# EAGLE design mainboard (EAGLE 9.6.2)
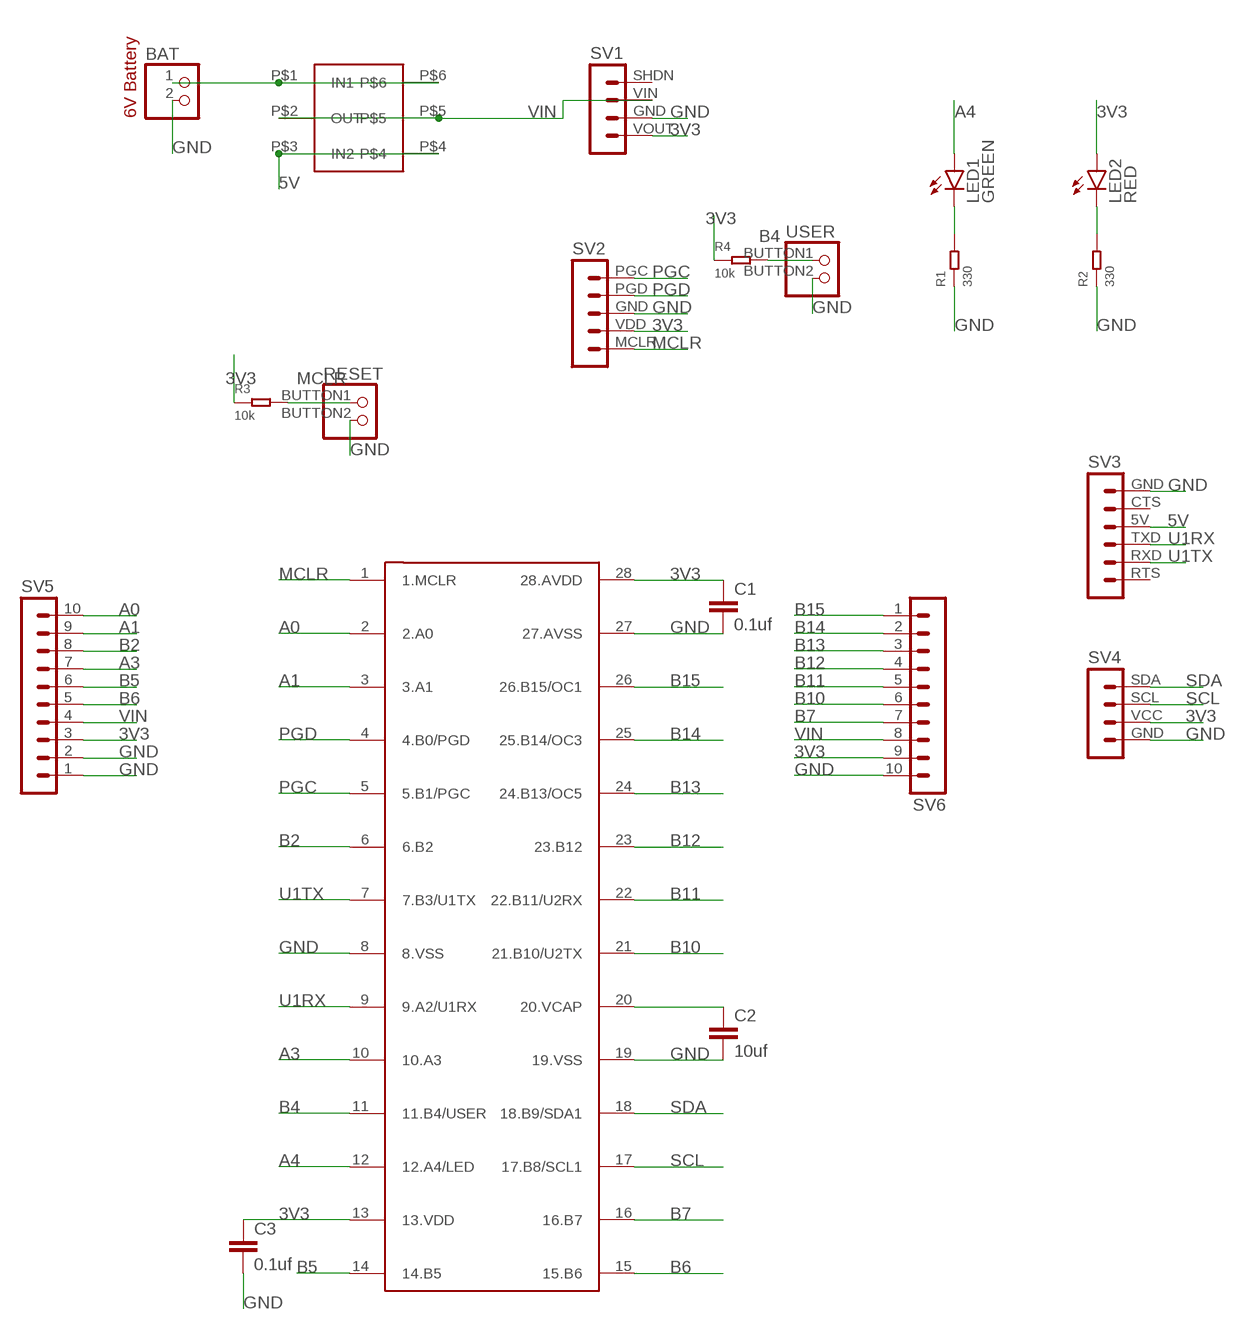
[diagram p0: schematic, sheet 1]

## Parts
BAT  PINHD-1X2  [1X02]
C1  0.1uf  C2,5-3  [C2.5-3]
C2  10uf  C2,5-3  [C2.5-3]
C3  0.1uf  C2,5-3  [C2.5-3]
LED1  GREEN  LED3MM  [LED3MM]
LED2  RED  LED3MM  [LED3MM]
R1  330  DIP-RES-1/4W(PR-D2.3XL6.5MM)  [PR-D2.3XL6.5MM]
R2  330  DIP-RES-1/4W(PR-D2.3XL6.5MM)  [PR-D2.3XL6.5MM]
R3  10k  DIP-RES-1/4W(PR-D2.3XL6.5MM)  [PR-D2.3XL6.5MM]
R4  10k  DIP-RES-1/4W(PR-D2.3XL6.5MM)  [PR-D2.3XL6.5MM]
RESET  PUSHBUTTON  [PUSHBUTTON]
SV1  POLOLU3.3POLOLU3.3  [POLOLU3.3]
SV2  MPLAB-SNAP  [MPLAB-SNAP]
SV3  CP2104FRIEND  [CP2104FRIEND]
SV4  SSD1306  [SSD1306]
SV5  MA10-1  [MA10-1]
SV6  MA10-1  [MA10-1]
U$1  SLIDE_SWITCH  [SLIDE]
U$2  PIC32MX170F256B  [DIL28-3]
USER  PUSHBUTTON  [PUSHBUTTON]

## Nets
3V3: C1.1 C3.1 LED2.A R3.1 R4.1 SV1.VOUT SV2.VDD SV4.VCC SV5.3 SV6.9 U$2.13(13.VDD) U$2.28(28.AVDD)
5V: SV3.5V U$1.P$3(IN2) U$1.P$4
A0: SV5.10 U$2.2(2.A0)
A1: SV5.9 U$2.3(3.A1)
A3: SV5.7 U$2.10(10.A3)
A4: LED1.A U$2.12(12.A4/LED)
B2: SV5.8 U$2.6(6.B2)
B4: R4.2 U$2.11(11.B4/USER) USER.BUTTON1
B5: SV5.6 U$2.14(14.B5)
B6: SV5.5 U$2.15(15.B6)
B7: SV6.7 U$2.16(16.B7)
B10: SV6.6 U$2.21(21.B10/U2TX)
B11: SV6.5 U$2.22(22.B11/U2RX)
B12: SV6.4 U$2.23(23.B12)
B13: SV6.3 U$2.24(24.B13/OC5)
B14: SV6.2 U$2.25(25.B14/OC3)
B15: SV6.1 U$2.26(26.B15/OC1)
GND: BAT.2 C1.2 C2.2 C3.2 R1.1 R2.1 RESET.BUTTON2 SV1.GND SV2.GND SV3.GND SV4.GND SV5.1 SV5.2 SV6.10 U$2.8(8.VSS) U$2.19(19.VSS) U$2.27(27.AVSS) USER.BUTTON2
MCLR: R3.2 RESET.BUTTON1 SV2.MCLR U$2.1(1.MCLR)
N$1: BAT.1 U$1.P$1(IN1) U$1.P$6
N$4: LED1.K(C) R1.2
N$7: LED2.K(C) R2.2
N$13: C2.1 U$2.20(20.VCAP)
PGC: SV2.PGC U$2.5(5.B1/PGC)
PGD: SV2.PGD U$2.4(4.B0/PGD)
SCL: SV4.SCL U$2.17(17.B8/SCL1)
SDA: SV4.SDA U$2.18(18.B9/SDA1)
U1RX: SV3.TXD U$2.9(9.A2/U1RX)
U1TX: SV3.RXD U$2.7(7.B3/U1TX)
VIN: SV1.VIN SV5.4 SV6.8 U$1.P$2(OUT) U$1.P$5
Unconnected: SV1.SHDN SV3.CTS SV3.RTS

## Notes on the sheet
- 6V Battery

## Library data of the parts
BAT = pinhead:PINHD-1X2: PIN HEADER
C1-C3 = HW4:C: CAPACITOR naming: grid - package width
LED1 LED2 = HW4:LED: LED OSRAM: - CHIPLED LG R971, LG N971, LY N971, LG Q971, LY Q971, LO R971, LY R971 LH N974, LH R974 LS Q976, LO Q976, LY Q976 LO Q996 - Hyper CHIPLED LW Q18S LB Q993, LB Q99A, LB R99A - SideLED LS A670, LO A670, LY A670, LG A670, LP A670 LB A673, LV A673, LT A673, LW A673 LH A674 LY A675 LS A676, LA A676, LO A676, LY A676, LW A676 LS A679, LY A679, LG A679 - Hyper Micro SIDELED® LS Y876, LA Y876, LO Y876, LY Y876 LT Y87S - SmartLED LW L88C, LW L88S LB L89C, LB L89S, LG L890 LS L89K, LO L89K, LY L89K LS L896, LA L896, LO L896, LY L896 - TOPLED LS T670, LO T670, LY T670, LG T670, LP T670 LSG T670, LSP T670, LSY T670, LOP T670, LYG T670 LG T671, LOG T671, LSG T671 LB T673, LV T673, LT T673, LW T673 LH T674 LS T676, LA T676, LO T676, LY T676, LB T676, LH T676, LSB T676, LW T676 LB T67C, LV T67C, LT T67C, LS T67K, LO T67K, LY T67K, LW E67C LS E67B, LA E67B, LO E67B, LY E67B, LB E67C, LV E67C, LT E67C LW T67C LS T679, LY T679, LG T679 LS T770, LO T770, LY T770, LG T770, LP T770 LB T773, LV T773, LT T773, LW T773 LH T774 LS E675, LA E675, LY E675, LS T675 LS T776, LA T776, LO T776, LY T776, LB T776 LHGB T686 LT T68C, LB T68C - Hyper Mini TOPLED® LB M676 - Mini TOPLED Santana® LG M470 LS M47K, LO M47K, LY M47K Source: http://www.osram.convergy.de LUXEON: - LUMILED® LXK2-PW12-R00, LXK2-PW12-S00, LXK2-PW14-U00, LXK2-PW14-V00 LXK2-PM12-R00, LXK2-PM12-S00, LXK2-PM14-U00 LXK2-PE12-Q00, LXK2-PE12-R00, LXK2-PE12-S00, LXK2-PE14-T00, LXK2-PE14-U00 LXK2-PB12-K00, LXK2-PB12-L00, LXK2-PB12-M00, LXK2-PB14-N00, LXK2-PB14-P00, LXK2-PB14-Q00 LXK2-PR12-L00, LXK2-PR12-M00, LXK2-PR14-Q00, LXK2-PR14-R00 LXK2-PD12-Q00, LXK2-PD12-R00, LXK2-PD12-S00 LXK2-PH12-R00, LXK2-PH12-S00 LXK2-PL12-P00, LXK2-PL12-Q00, LXK2-PL12-R00 Source: www.luxeon.com KINGBRIGHT: KA-3528ASYC Source: www.kingbright.com
R1-R4 = HW4:DIP-RES-1/4W(PR-D2.3XL6.5MM): 301020021; MPN: FHCFR-1/4W-334J; VALUE: 330K
RESET USER = HW4:PUSHBUTTON: PIN HEADER
SV1 = HW4:POLOLU3.3: PIN HEADER
SV2 = HW4:MPLAB-SNAP: PIN HEADER; OC_FARNELL: unknown; OC_NEWARK: unknown
SV3 = HW4:CP2104FRIEND: PIN HEADER; OC_FARNELL: unknown; OC_NEWARK: unknown
SV4 = HW4:SSD1306: PIN HEADER; OC_FARNELL: unknown; OC_NEWARK: unknown
SV5 SV6 = con-lstb:MA10-1: PIN HEADER; OC_FARNELL: unknown; OC_NEWARK: unknown
U$1 = HW4:SLIDE_SWITCH
U$2 = HW4:PIC32MX170F256B

## Board
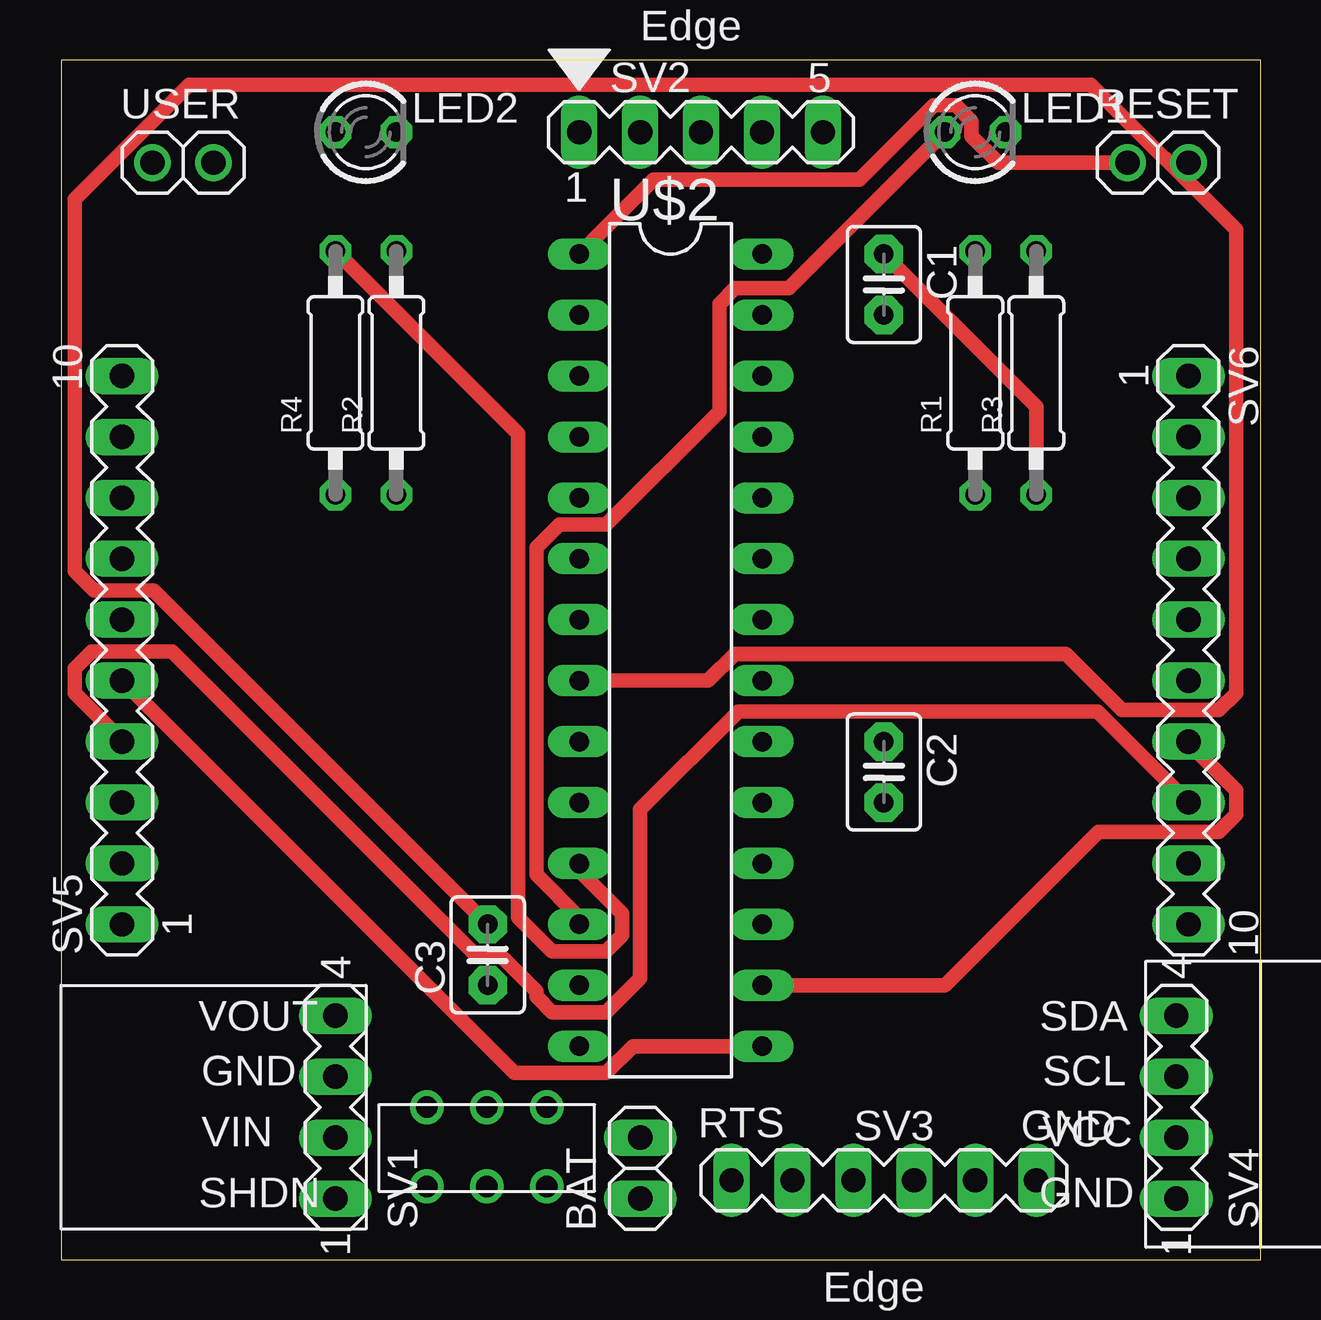
[diagram p1: board, top side]
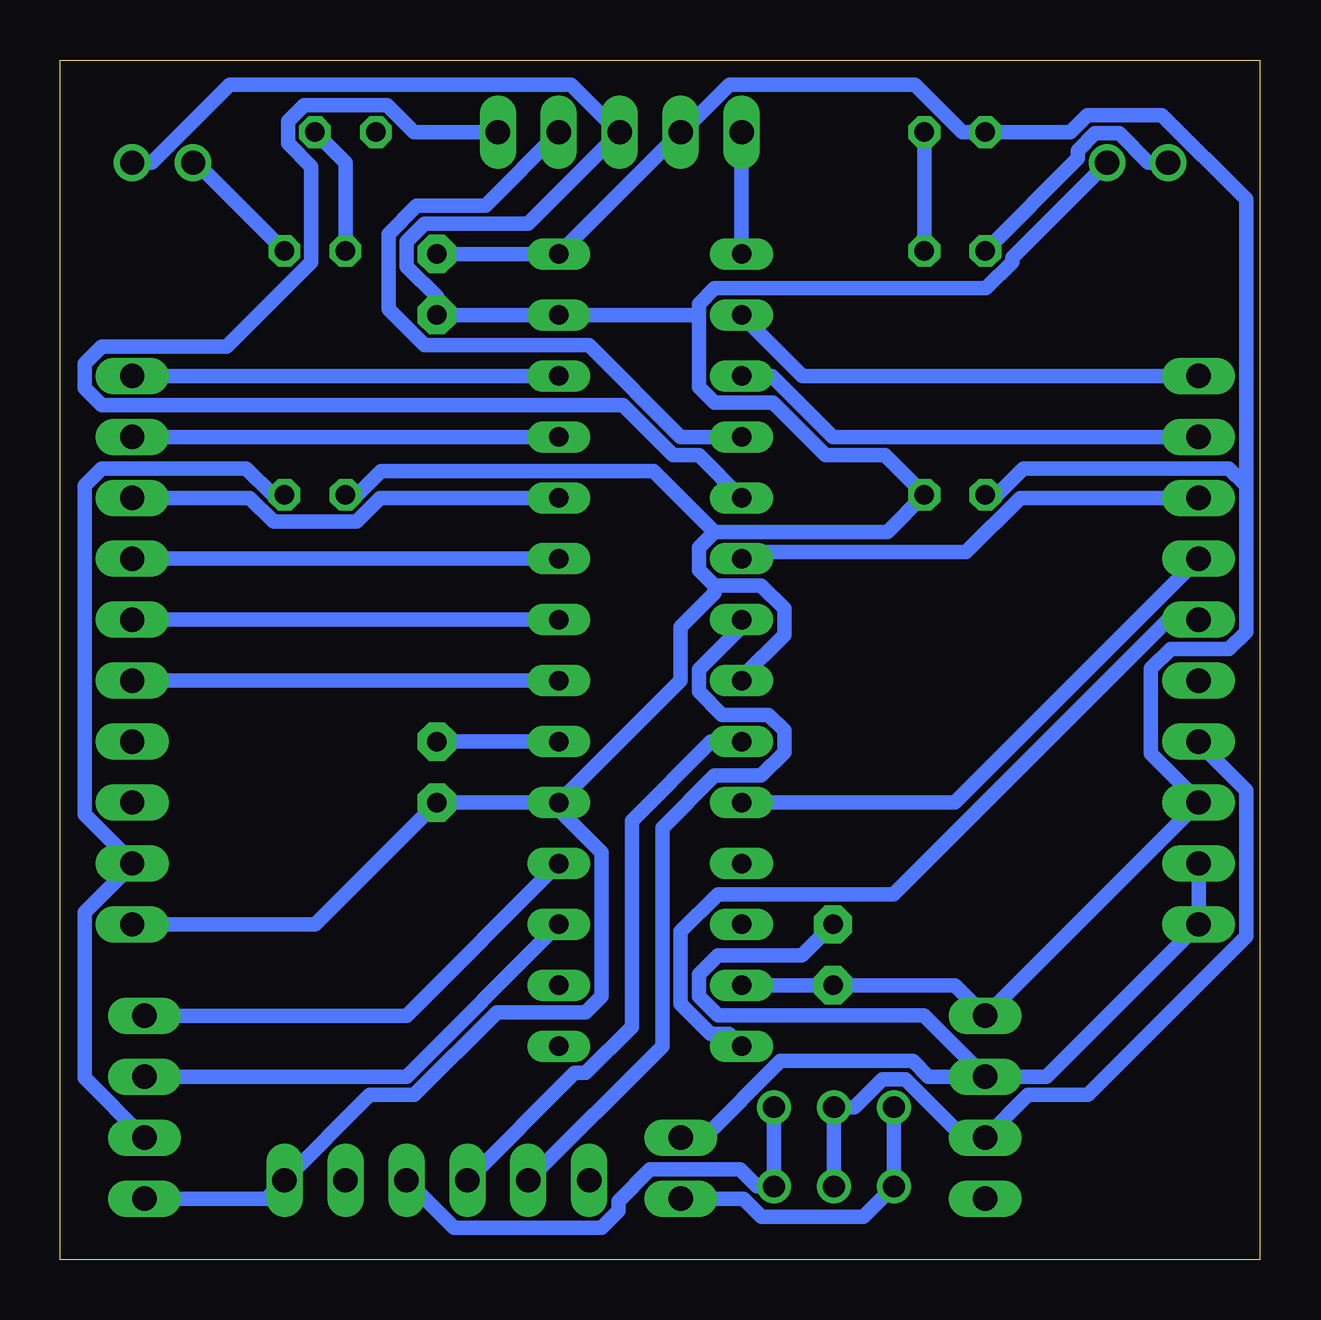
[diagram p2: board, bottom side, seen from below]

Size 50 x 50 mm. Coordinates in mm from the lower left corner, seen from the top.
Outline: 0,0 50,0 50,50 0,50 0,0
Copper layers (1*16): Top 0.035mm / dielectric 1.5mm / Bottom 0.035mm
Design rules "default *": minimum track width 6mil, minimum drill 0.35mm, track to track 6mil, track to pad 6mil, pad to pad 6mil, via to via 6mil, smd to smd 6mil, copper to edge 10mil, drill to drill 6mil, minimum pad ring 10mil, minimum via ring 8mil, stop-mask expansion 4mil, vias tented up to drill 0mil, thermal gap 10mil

### Footprints (pad centres in the part's own frame; a part is rotated, then mirrored left to right if it is on the bottom)
1X02 = drill 1.016 long: 1 -1.27,0; 2 1.27,0
C2.5-3 = drill 0.813 pad 1.6 octagon: 1 -1.27,0; 2 1.27,0
LED3MM = drill 0.813 octagon: A -1.27,0; K 1.27,0
PR-D2.3XL6.5MM = drill 0.813 octagon: 1 -4.953,0; 2 5.207,0
PUSHBUTTON = drill 1.016: BUTTON1 -2.54,0; BUTTON2 0,0
POLOLU3.3 = drill 1.016 long: GND 1.27,0; SHDN 1.27,-5.08; VIN 1.27,-2.54; VOUT 1.27,2.54
MPLAB-SNAP = drill 1.016 long: GND 0,0; MCLR -5.08,0; PGC 5.08,0; PGD 2.54,0; VDD -2.54,0
CP2104FRIEND = drill 1.016 long: 5V 1.27,0; CTS 3.81,0; GND 6.35,0; RTS -6.35,0; RXD -3.81,0; TXD -1.27,0
SSD1306 = drill 1.016 long: GND 1.27,-5.08; SCL 1.27,0; SDA 1.27,2.54; VCC 1.27,-2.54
MA10-1 = drill 1.016 long: 1 -11.43,0; 2 -8.89,0; 3 -6.35,0; 4 -3.81,0; 5 -1.27,0; 6 1.27,0; 7 3.81,0; 8 6.35,0; 9 8.89,0; 10 11.43,0
SLIDE = drill 0.9: P$1 0,0; P$2 2.5,0; P$3 5,0; P$4 5,3.3; P$5 2.5,3.3; P$6 0,3.3
DIL28-3 = drill 0.813 long: 1 -16.51,-3.81; 2 -13.97,-3.81; 3 -11.43,-3.81; 4 -8.89,-3.81; 5 -6.35,-3.81; 6 -3.81,-3.81; 7 -1.27,-3.81; 8 1.27,-3.81; 9 3.81,-3.81; 10 6.35,-3.81; 11 8.89,-3.81; 12 11.43,-3.81; 13 13.97,-3.81; 14 16.51,-3.81; 15 16.51,3.81; 16 13.97,3.81; 17 11.43,3.81; 18 8.89,3.81; 19 6.35,3.81; 20 3.81,3.81; 21 1.27,3.81; 22 -1.27,3.81; 23 -3.81,3.81; 24 -6.35,3.81; 25 -8.89,3.81; 26 -11.43,3.81; 27 -13.97,3.81; 28 -16.51,3.81

### Placement (x,y rotation side)
BAT  24.13,3.81 90 top
C1  34.29,40.64 270 top
C2  34.29,20.32 270 top
C3  17.78,12.7 90 top
LED1  38.1,46.99 0 top
LED2  12.7,46.99 0 top
R1  38.1,36.83 90 top
R2  13.97,36.83 90 top
R3  40.64,36.83 90 top
R4  11.43,36.83 90 top
RESET  46.99,45.72 0 top
SV1  10.16,7.62 0 top
SV2  26.67,46.99 0 top
SV3  34.29,3.3 0 top
SV4  45.21,7.62 0 top
SV5  2.54,25.4 90 top
SV6  46.99,25.4 270 top
U$1  15.24,3.05 0 top
U$2  25.4,25.4 270 top
USER  6.35,45.72 0 top

### Tracks (layer width: path | path; a pad name or v marks a point on that pad's centre or on a via)
3V3
  Top 0.61: C1.1 40.64,35.56 R3.1
  Bottom 0.61: C1.1 U$2.28 SV2.VDD 24.08,46.99 22.09,48.97 14.37,48.97 12.39,46.99 LED2.A 7.88,46.99 7.17,47.7 4.07,47.7 0.56,44.19 0.56,32.26 | U$2.13 C3.1 12.7,11.43 SV1.VOUT SV5.3 2.54,19.1 4.52,21.09 4.52,24.64 3.71,25.45 1.27,25.45 0.56,26.16 0.56,32.26 | 0.56,32.26 1.27,32.97 9.84,32.97 10.93,31.88 R4.1 | SV4.VCC 48.97,7.57 48.97,14.47 46.99,16.46 SV6.9 46.99,16.56 48.97,18.55 48.97,32.26 48.26,32.97 42.23,32.97 41.14,31.88 R3.1
5V
  Bottom 0.61: U$1.P$4 U$1.P$3 20.95,3.05 21.66,3.76 25.4,3.76 26.72,2.44 26.72,2.04 27.43,1.32 33.58,1.32 SV3.5V
A0
  Bottom 0.61: SV5.10 19.05,36.83 U$2.2
A1
  Bottom 0.61: SV5.9 17.78,34.29 20.32,36.83 U$2.3
A3
  Bottom 0.61: U$2.10 12.7,19.05 SV5.7
A4
  Top 0.61: LED1.A 30.33,40.49 28.09,40.49 27.43,39.83 27.43,35.35 22.71,30.63 20.77,30.63 19.81,29.67 19.81,16.05 21.59,14.27 U$2.12
B2
  Bottom 0.61: SV5.8 9.98,31.75 12.24,29.49 21.31,29.49 U$2.6
B4
  Top 0.61: R4.2 19.05,34.42 19.05,14.27 20.47,12.85 22.71,12.85 23.37,13.51 23.37,14.43 21.59,16.21 U$2.11
  Bottom 0.61: USER.BUTTON1 4.63,45.72 5.84,46.94 6.86,46.94 7.57,46.23 7.57,45.9 R4.2
B5
  Bottom 0.61: SV5.6 3.81,26.67 15.25,15.23 22.57,15.23 24.13,13.67 24.13,10.65 22.89,9.41 22.11,9.41 U$2.14
B6
  Top 0.61: U$2.15 23.83,8.89 22.71,7.77 18.9,7.77 SV5.5
B7
  Top 0.61: U$2.16 36.83,11.43 43.23,17.83 48.26,17.83 48.97,18.55 48.97,19.55 46.99,21.54 SV6.7
B10
  Bottom 0.61: SV6.6 U$2.21
B11
  Bottom 0.61: U$2.22 SV6.5
B12
  Bottom 0.61: SV6.4 U$2.23
B13
  Bottom 0.61: SV6.3 42.09,31.75 41.1,30.76 37.64,30.76 36.65,31.75 U$2.24
B14
  Bottom 0.61: SV6.2 U$2.25
B15
  Bottom 0.61: SV6.1 U$2.26
GND
  Top 0.61: C3.2 3.86,27.89 1.38,27.89 0.56,28.7 0.56,44.19 5.34,48.97 42.92,48.97 48.97,42.92 48.97,23.62 48.26,22.91 44.21,22.91 41.87,25.25 28.09,25.25 26.97,24.13 U$2.8
  Bottom 0.61: U$2.19 C2.2 39.37,13.97 SV6.10 | SV4.GND 41.4,2.54 SV3.GND 37.08,6.86 35.24,6.86 31.79,10.31 28.09,10.31 27.43,10.97 27.43,16.97 29.21,18.75 U$2.19 | SV1.GND 8.89,7.62 SV5.1 SV5.2 | SV1.GND 13.98,10.17 22.57,10.17 23.37,10.97 23.37,11.89 22.57,12.69 19.06,12.69 C3.2 | SV1.GND 13.79,7.62 14.44,8.27 19.96,8.27 23.15,5.08 BAT.2 | U$2.8 21.59,24.26 19.81,26.04 19.81,27.13 20.77,28.09 22.71,28.09 | 22.71,30.33 23.37,29.67 23.37,28.75 22.71,28.09 | 22.71,30.33 15.52,30.33 R2.1 15.62,33.53 18.1,33.53 20.28,35.71 22.71,35.71 23.37,36.37 23.37,39.37 | USER.BUTTON2 10.31,41.76 10.31,41.57 11.4,40.49 22.71,40.49 23.37,39.83 23.37,39.37 | U$2.19 24.13,24.13 24.13,26.37 22.71,27.79 22.71,28.09 | 23.37,39.37 U$2.27 C1.2 34.29,40.13 35.55,41.39 35.55,42.43 34.81,43.17 30.49,43.17 SV2.GND 26.72,46.99 28.7,48.97 42.92,48.97 46.17,45.72 RESET.BUTTON2 | R1.1 37.6,31.88 36.61,32.87 25.25,32.87 22.71,30.33
MCLR
  Top 0.61: U$2.1 24.69,45.01 33.27,45.01 36.37,48.11 37.29,48.11 37.95,47.45 37.95,46.83 39.06,45.72 RESET.BUTTON1
  Bottom 0.61: R3.2 44.32,45.72 RESET.BUTTON1 | U$2.1 SV2.MCLR 21.64,46.99
N$1
  Bottom 0.61: BAT.1 21.52,2.54 20.76,1.78 16.5,1.78 U$1.P$1 U$1.P$6
N$4
  Bottom 0.61: R1.2 38.1,45.72 LED1.K
N$7
  Bottom 0.61: LED2.K R2.2
N$13
  Bottom 0.61: U$2.20 C2.1
PGC
  Bottom 0.61: U$2.5 23.37,33.53 24.45,33.53 26.53,35.61 48.26,35.61 48.97,36.33 48.97,37.34 48.26,38.05 43.05,38.05 39.52,41.57 39.52,45.56 40.49,46.53 40.49,47.45 39.83,48.11 36.37,48.11 35.25,46.99 SV2.PGC
PGD
  Bottom 0.61: SV2.PGD 32.27,43.93 35.13,43.93 36.31,42.75 36.31,39.61 34.81,38.11 27.95,38.11 24.13,34.29 U$2.4
SCL
  Bottom 0.61: SV4.SCL 35.56,7.62 U$2.17
SDA
  Bottom 0.61: SV4.SDA 35.56,10.16 U$2.18
U1RX
  Bottom 0.61: U$2.9 22.86,21.59 26.16,18.29 26.16,9.7 28.09,7.77 28.55,7.77 SV3.TXD
U1TX
  Bottom 0.61: SV3.RXD 24.89,8.89 24.89,17.99 22.71,20.17 20.77,20.17 19.81,21.13 19.81,22.05 20.47,22.71 22.41,22.71 23.37,23.67 23.37,24.59 21.59,26.37 U$2.7
VIN
  Top 0.61: SV5.4 2.54,21.64 0.56,23.62 0.56,24.64 1.27,25.35 4.62,25.35 17.26,12.71 18.27,12.71 19.81,11.18 19.81,10.97 20.47,10.31 22.71,10.31 24.13,11.73 24.13,18.75 28.23,22.85 43.19,22.85 SV6.8
  Bottom 0.61: U$1.P$2 U$1.P$5 16.88,6.35 15.72,7.51 14.76,7.51 12.33,5.08 SV1.VIN 9.65,6.86 7.17,6.86 0.56,13.46 0.56,19.55 2.54,21.54 SV5.4